# EAGLE design backplane (EAGLE 6.2)
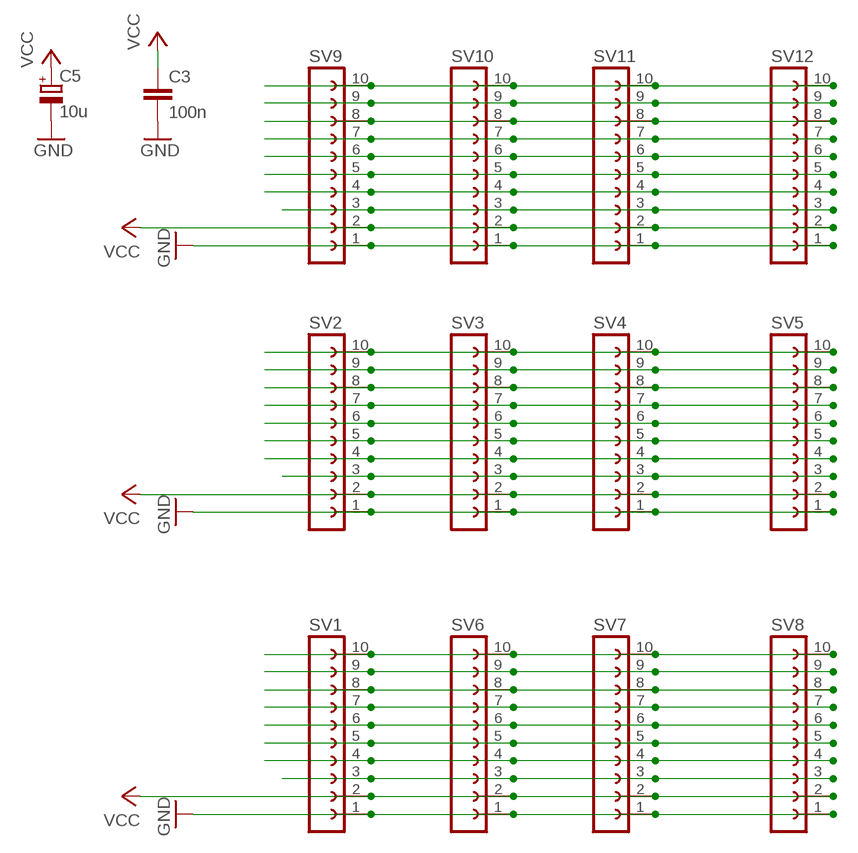
[diagram p0: schematic, sheet 1]

## Parts
C3  100n  C-EU025-024X044  [C025-024X044]
C5  10u  CPOL-EUE2,5-6E  [E2,5-6E]
SV1  FE10-1  [FE10]
SV2  FE10-1  [FE10]
SV3  FE10-1  [FE10]
SV4  FE10-1  [FE10]
SV5  FE10-1  [FE10]
SV6  FE10-1  [FE10]
SV7  FE10-1  [FE10]
SV8  FE10-1  [FE10]
SV9  FE10-1  [FE10]
SV10  FE10-1  [FE10]
SV11  FE10-1  [FE10]
SV12  FE10-1  [FE10]

## Nets
GND: C3.2 C5.- SV1.1 SV2.1 SV3.1 SV4.1 SV5.1 SV6.1 SV7.1 SV8.1 SV9.1 SV10.1 SV11.1 SV12.1
N$1: SV2.4 SV3.4 SV4.4 SV5.4
N$2: SV2.10 SV3.10 SV4.10 SV5.10
N$3: SV2.3 SV3.3 SV4.3 SV5.3
N$4: SV2.9 SV3.9 SV4.9 SV5.9
N$5: SV2.8 SV3.8 SV4.8 SV5.8
N$6: SV2.7 SV3.7 SV4.7 SV5.7
N$7: SV2.6 SV3.6 SV4.6 SV5.6
N$8: SV2.5 SV3.5 SV4.5 SV5.5
N$9: SV1.10 SV6.10 SV7.10 SV8.10
N$10: SV1.9 SV6.9 SV7.9 SV8.9
N$11: SV1.8 SV6.8 SV7.8 SV8.8
N$12: SV1.7 SV6.7 SV7.7 SV8.7
N$13: SV1.6 SV6.6 SV7.6 SV8.6
N$14: SV1.5 SV6.5 SV7.5 SV8.5
N$15: SV1.4 SV6.4 SV7.4 SV8.4
N$16: SV1.3 SV6.3 SV7.3 SV8.3
N$17: SV9.10 SV10.10 SV11.10 SV12.10
N$18: SV9.9 SV10.9 SV11.9 SV12.9
N$19: SV9.8 SV10.8 SV11.8 SV12.8
N$20: SV9.7 SV10.7 SV11.7 SV12.7
N$21: SV9.6 SV10.6 SV11.6 SV12.6
N$22: SV9.5 SV10.5 SV11.5 SV12.5
N$23: SV9.4 SV10.4 SV11.4 SV12.4
N$24: SV9.3 SV10.3 SV11.3 SV12.3
VCC: C3.1 C5.+ SV1.2 SV2.2 SV3.2 SV4.2 SV5.2 SV6.2 SV7.2 SV8.2 SV9.2 SV10.2 SV11.2 SV12.2

## Library data of the parts
C3 = rcl:C-EU: CAPACITOR, European symbol
C5 = rcl:CPOL-EU: POLARIZED CAPACITOR, European symbol
SV1-SV12 = con-lsta:FE10-1: FEMALE HEADER

## Board
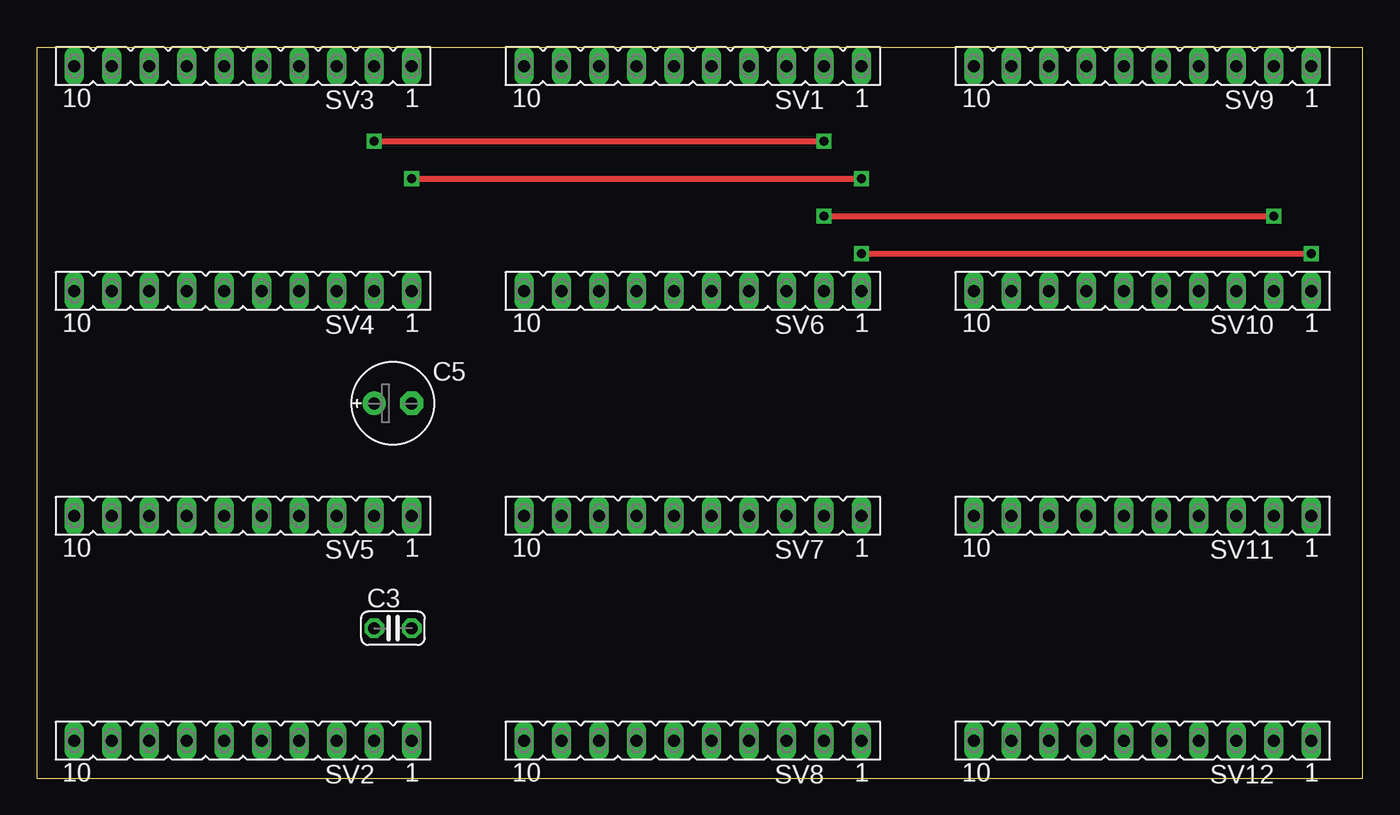
[diagram p1: board, top side]
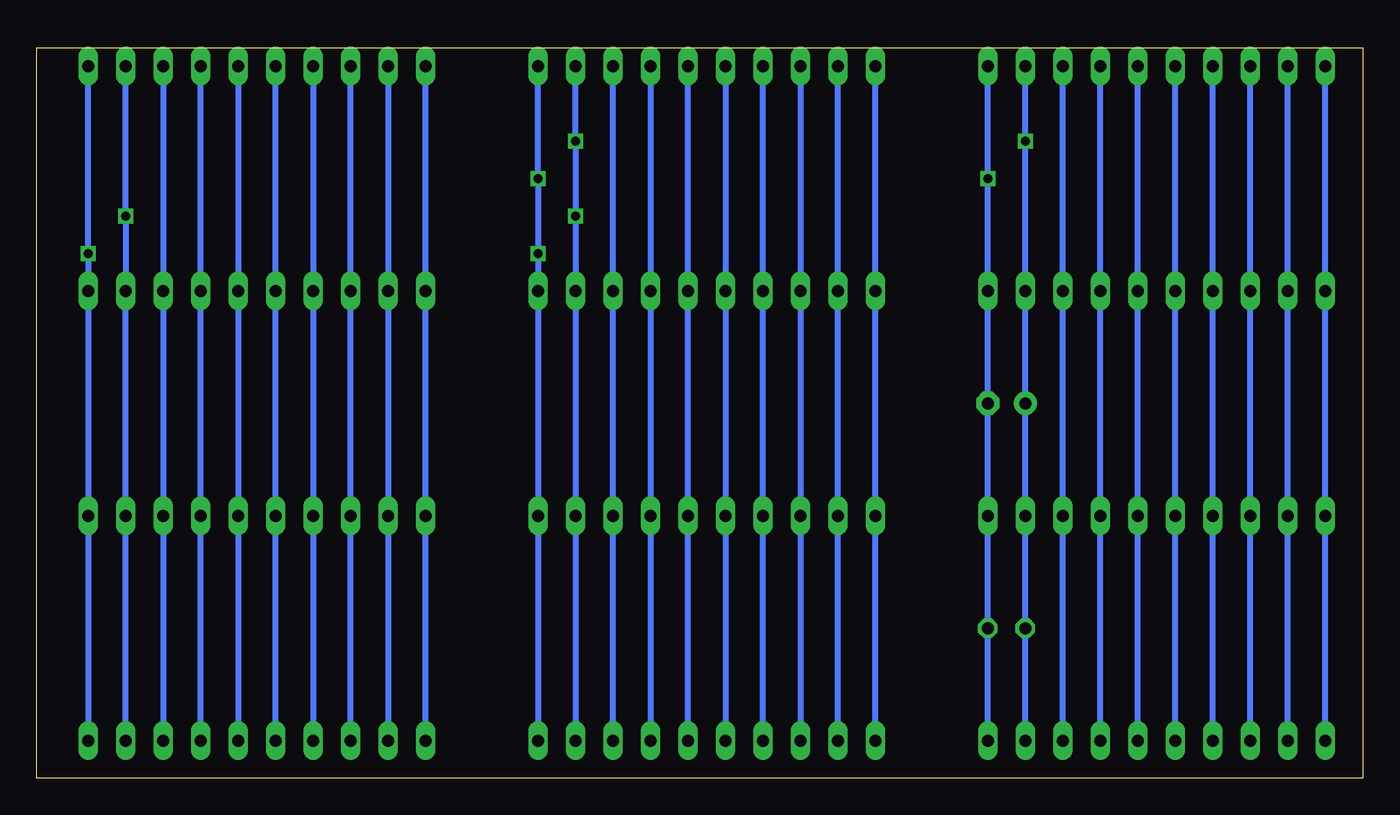
[diagram p2: board, bottom side, seen from below]

Size 89.84 x 49.52 mm. Coordinates in mm from the lower left corner, seen from the top.
Outline: 0,0 89.84,0 89.84,49.52 0,49.52 0,0
Copper layers (1*16): Top 0.035mm / dielectric 1.5mm / Bottom 0.035mm
Design rules: minimum track width 10mil, minimum drill 24mil, track to track 8mil, track to pad 8mil, pad to pad 8mil, via to via 8mil, smd to smd 8mil, copper to edge 40mil, drill to drill 8mil, minimum pad ring 10mil, minimum via ring 8mil, stop-mask expansion 4mil, vias tented up to drill 0mil, thermal gap 10mil

### Footprints (pad centres in the part's own frame; a part is rotated, then mirrored left to right if it is on the bottom)
C025-024X044 = drill 0.813 octagon: 1 -1.27,0; 2 1.27,0
E2,5-6E = drill 0.813 pad 1.575: + -1.27,0 | drill 0.813 pad 1.575 octagon: - 1.27,0
FE10 = drill 0.813 long: 1 -11.43,0; 2 -8.89,0; 3 -6.35,0; 4 -3.81,0; 5 -1.27,0; 6 1.27,0; 7 3.81,0; 8 6.35,0; 9 8.89,0; 10 11.43,0

### Placement (x,y rotation side)
C3  24.13,10.16 0 top
C5  24.13,25.4 0 top
SV1  44.45,48.26 180 top
SV2  13.97,2.54 180 top
SV3  13.97,48.26 180 top
SV4  13.97,33.02 180 top
SV5  13.97,17.78 180 top
SV6  44.45,33.02 180 top
SV7  44.45,17.78 180 top
SV8  44.45,2.54 180 top
SV9  74.93,48.26 180 top
SV10  74.93,33.02 180 top
SV11  74.93,17.78 180 top
SV12  74.93,2.54 180 top

### Tracks (layer width: path | path; a pad name or v marks a point on that pad's centre or on a via)
GND  (via drill 0.6)
  Top 0.406: v55.88,35.56 v86.36,35.56 | v25.4,40.64 v55.88,40.64
  Bottom 0.406: SV2.1 C3.2 SV5.1 C5.- SV4.1 v25.4,40.64 SV3.1 | SV8.1 SV7.1 SV6.1 v55.88,35.56 v55.88,40.64 SV1.1 | SV9.1 v86.36,35.56 SV10.1 SV11.1 SV12.1
N$1
  Bottom 0.406: SV3.4 SV4.4 SV5.4 SV2.4
N$2
  Bottom 0.406: SV3.10 SV4.10 SV5.10 SV2.10
N$3
  Bottom 0.406: SV2.3 SV5.3 SV4.3 SV3.3
N$4
  Bottom 0.406: SV2.9 SV5.9 SV4.9 SV3.9
N$5
  Bottom 0.406: SV3.8 SV4.8 SV5.8 SV2.8
N$6
  Bottom 0.406: SV2.7 SV5.7 SV4.7 SV3.7
N$7
  Bottom 0.406: SV3.6 SV4.6 SV5.6 SV2.6
N$8
  Bottom 0.406: SV2.5 SV5.5 SV4.5 SV3.5
N$9
  Bottom 0.406: SV8.10 SV7.10 SV6.10 SV1.10
N$10
  Bottom 0.406: SV8.9 SV7.9 SV6.9 SV1.9
N$11
  Bottom 0.406: SV1.8 SV6.8 SV7.8 SV8.8
N$12
  Bottom 0.406: SV8.7 SV7.7 SV6.7 SV1.7
N$13
  Bottom 0.406: SV1.6 SV6.6 SV7.6 SV8.6
N$14
  Bottom 0.406: SV8.5 SV7.5 SV6.5 SV1.5
N$15
  Bottom 0.406: SV1.4 SV6.4 SV7.4 SV8.4
N$16
  Bottom 0.406: SV8.3 SV7.3 SV6.3 SV1.3
N$17
  Bottom 0.406: SV12.10 SV11.10 SV10.10 SV9.10
N$18
  Bottom 0.406: SV9.9 SV10.9 SV11.9 SV12.9
N$19
  Bottom 0.406: SV12.8 SV11.8 SV10.8 SV9.8
N$20
  Bottom 0.406: SV9.7 SV10.7 SV11.7 SV12.7
N$21
  Bottom 0.406: SV12.6 SV11.6 SV10.6 SV9.6
N$22
  Bottom 0.406: SV9.5 SV10.5 SV11.5 SV12.5
N$23
  Bottom 0.406: SV12.4 SV11.4 SV10.4 SV9.4
N$24
  Bottom 0.406: SV9.3 SV10.3 SV11.3 SV12.3
VCC  (via drill 0.6)
  Top 0.406: v53.34,38.1 v83.82,38.1 | v22.86,43.18 v53.34,43.18
  Bottom 0.406: SV2.2 C3.1 SV5.2 C5.+ SV4.2 v22.86,43.18 SV3.2 | SV1.2 v53.34,43.18 v53.34,38.1 SV6.2 SV7.2 SV8.2 | SV9.2 v83.82,38.1 SV10.2 SV11.2 SV12.2